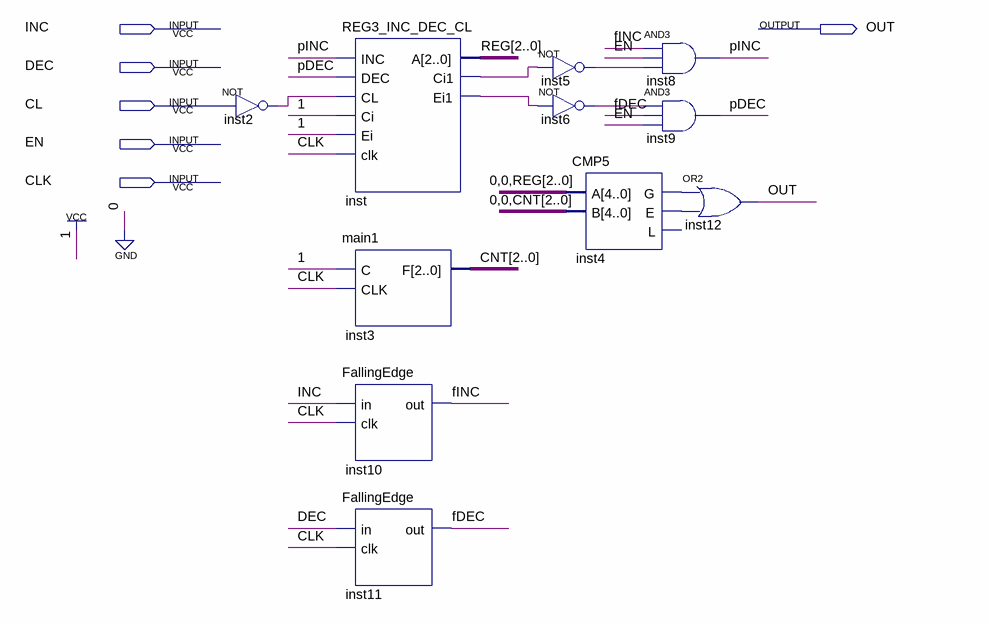
[diagram p0: schematic sheet]
// Quartus schematic main2.bdf as structural Verilog: 11 symbols, 6 pins
module main2 (
  input  INC,
  input  DEC,
  input  CL,
  input  EN,
  input  CLK,
  output OUT
);

  wire fDEC, fINC, inst2_out, inst4_e, inst4_g, inst5_out, inst6_out, inst_ci1, inst_ei1, pDEC, pINC;
  wire [2:0] CNT, REG;

  not inst2 (inst2_out, CL);
  REG3_INC_DEC_CL inst (
    .INC(pINC), .DEC(pDEC), .CL(inst2_out), .Ci(1'b1), .Ei(1'b1), .clk(CLK), .A(REG), .Ci1(inst_ci1),
    .Ei1(inst_ei1));
  main1 inst3 (.C(1'b1), .CLK(CLK), .F(CNT));
  FallingEdge inst10 (.in(INC), .clk(CLK), .out(fINC));
  FallingEdge inst11 (.in(DEC), .clk(CLK), .out(fDEC));
  not inst5 (inst5_out, inst_ci1);
  not inst6 (inst6_out, inst_ei1);
  CMP5 inst4 (.A({2'b00, REG}), .B({2'b00, CNT}), .G(inst4_g), .E(inst4_e));  // open: L
  and inst8 (pINC, fINC, EN, inst5_out);
  and inst9 (pDEC, inst6_out, fDEC, EN);
  or inst12 (OUT, inst4_g, inst4_e);
endmodule
